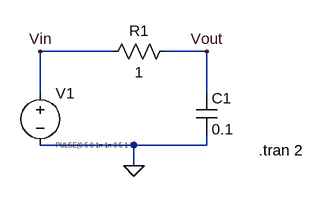
[diagram p0: schematic RC_Circuit.asc]
RC_Circuit.asc, the LTspice schematic file:
Version 4.1
SHEET 1 880 680
WIRE 48 96 -64 96
WIRE 192 96 128 96
WIRE -64 160 -64 96
WIRE 192 160 192 96
WIRE 80 240 -64 240
WIRE 192 240 192 224
WIRE 192 240 80 240
WIRE 80 272 80 240
FLAG 80 272 0
FLAG -64 96 Vin
FLAG 192 96 Vout
SYMBOL res 144 80 R90
WINDOW 0 0 56 VBottom 2
WINDOW 3 32 56 VTop 2
SYMATTR InstName R1
SYMATTR Value 1
SYMBOL cap 176 160 R0
SYMATTR InstName C1
SYMATTR Value 0.1
SYMBOL voltage -64 144 R0
WINDOW 3 24 96 Left 0
WINDOW 123 0 0 Left 0
WINDOW 39 0 0 Left 0
SYMATTR InstName V1
SYMATTR Value PULSE(0 5 0 1n 1n 0.5 1 5)
TEXT 272 248 Left 2 !.tran 2

The netlist it stands for:
* RC_Circuit.asc
R1 Vout Vin 1
C1 Vout 0 0.1
V1 Vin 0 PULSE(0 5 0 1n 1n 0.5 1 5)
.tran 2
.backanno
.end